# Altium project IntelliModule-Alpha-Baseboard.PrjPcb (part 1 of 2)
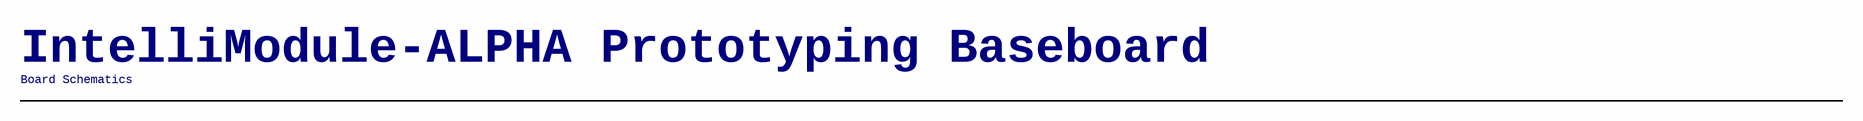
[diagram p0: [01] - Index.SchDoc]
4 sheets, 35 parts. Net scope: global (net labels, ports and power ports of the same name join across sheets).
Board file: IntelliModule-Alpha-Baseboard.PcbDoc
Sheets:
  [01] - Index.SchDoc
  [02] - Module Connector.SchDoc
  [03] - External Connectors.SchDoc
  [04] - Power Supply.SchDoc

## Sheet [01] - Index.SchDoc: Index
size A3; Date: N.A.; ApprovedBy: N.A.; CheckedBy: N.A.; Author: N.A.; CompanyName: Johannes Berndorfer; DrawnBy: JBE; Organization: N.A.; Address1: Konrad Grefe Gasse 22; Address2: 1230 Wien; Address3: AUSTRIA; Address4: N.A.; DocumentNumber: 1; Revision: A; SheetNumber: 1; SheetTotal: 4; ProjectTitle: IntelliModule-Alpha Prototyping Baseboard; Reviewer: -; Time: N.A.; ImagePath: N.A.; Application_BuildNumber: N.A.

### Notes on the sheet
- IntelliModule-ALPHA Prototyping Baseboard
- Board Schematics
- Title:
- Project:
- Document Nr.:
- Revision:
- Date:
- Drawn By:
- Time:
- Reviewed By:
- Sheet
- of
- Size:
- A3
- Variant:
- File:

## Sheet [02] - Module Connector.SchDoc: Module Connector
size A3; Date: N.A.; ApprovedBy: N.A.; CheckedBy: N.A.; Author: N.A.; CompanyName: Johannes Berndorfer; DrawnBy: JBE; Organization: N.A.; Address1: Konrad Grefe Gasse 22; Address2: 1230 Wien; Address3: AUSTRIA; Address4: N.A.; DocumentNumber: 2; Revision: A; SheetNumber: 2; SheetTotal: 4; ProjectTitle: IntelliModule-Alpha Prototyping Baseboard; Reviewer: -; Time: N.A.; ImagePath: N.A.; Application_BuildNumber: N.A.
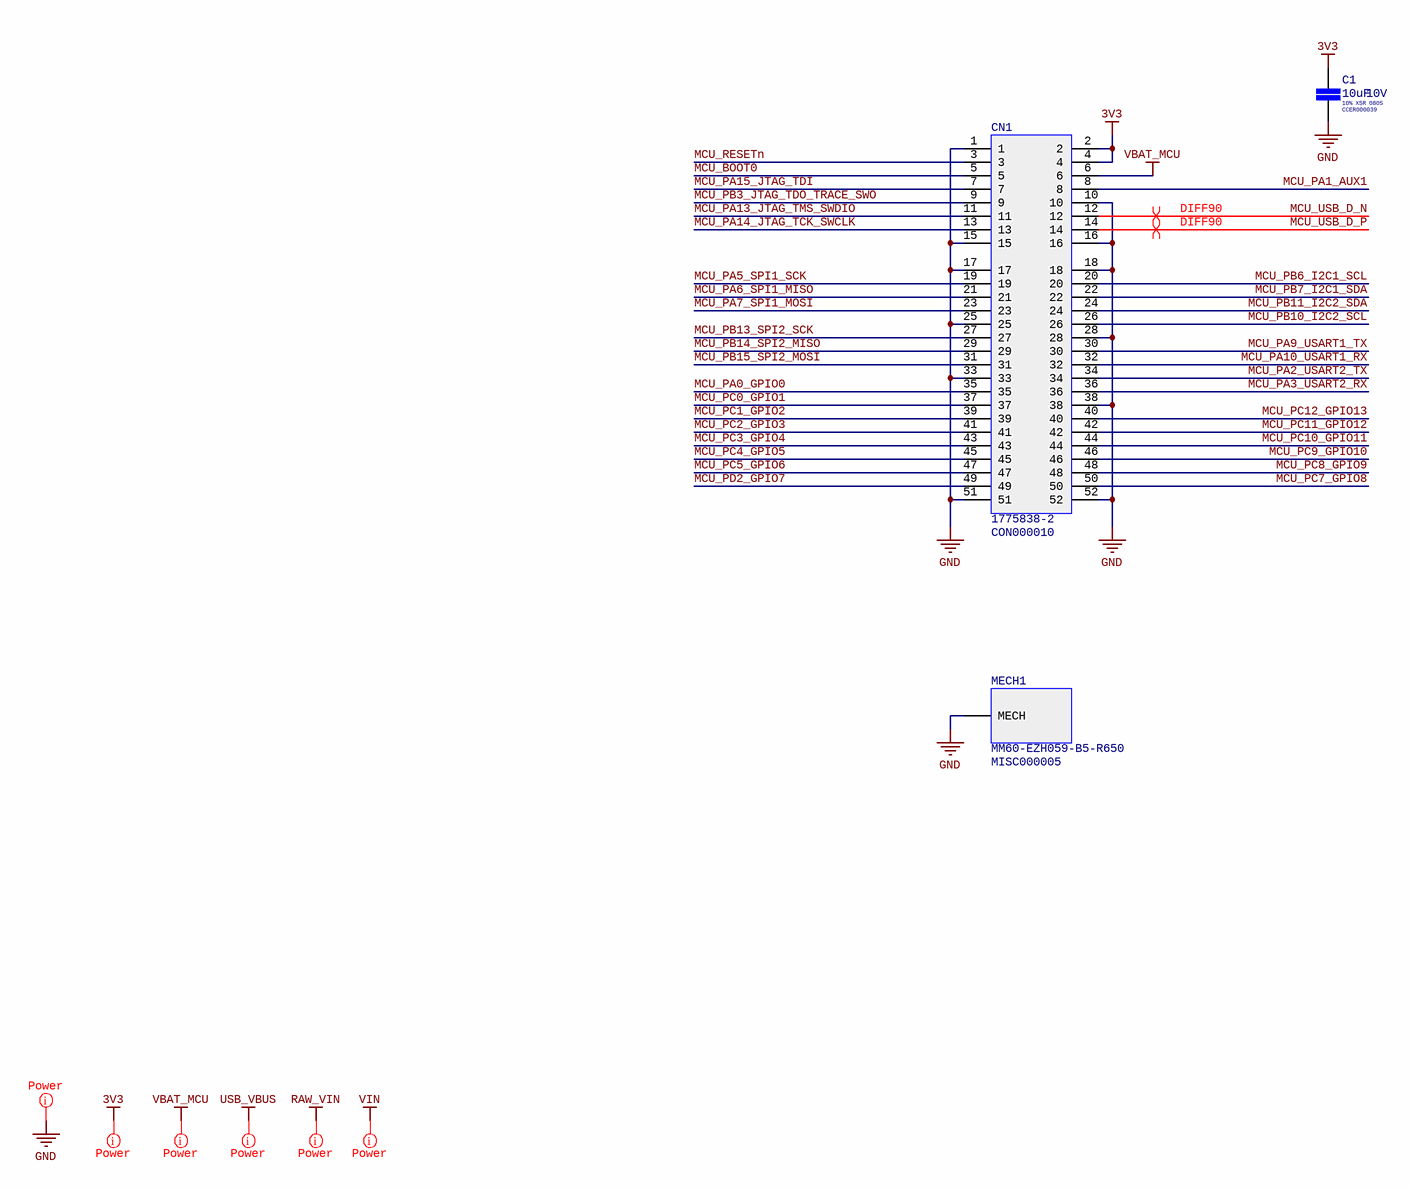
[diagram p1: [02] - Module Connector.SchDoc]

### Parts
C1  Internal Part Number: CCER000039  Tolerance: 10%  Voltage Rating: 10V  Dielectric: X5R  Case/Package: 0805  Capacitance: 10uF  [CAP-SMD-0805-1.35MM-IPC-MED]  (hidden comment: 10uF 10V)
CN1  1775838-2  Internal Part Number: CON000010  [CON-SMD-PCIE-MINI-52POS-1775838-2-TE]
MECH1  MM60-EZH059-B5-R650  Internal Part Number: MISC000005  [CON-SMD-PCIE-MINI-LATCH-0POS-MM60-EZH059-B5-R650-JAE]

### Nets
3V3: C1.1 CN1.2 CN1.4
GND: C1.2 CN1.1 CN1.10 CN1.15 CN1.16 CN1.17 CN1.18 CN1.25 CN1.28 CN1.33 CN1.38 CN1.51 CN1.52 MECH1.0(MECH)
VBAT_MCU: CN1.6
MCU_BOOT0: CN1.5
MCU_PA0_GPIO0: CN1.35
MCU_PA1_AUX1: CN1.8
MCU_PA2_USART2_TX: CN1.34
MCU_PA3_USART2_RX: CN1.36
MCU_PA5_SPI1_SCK: CN1.19
MCU_PA6_SPI1_MISO: CN1.21
MCU_PA7_SPI1_MOSI: CN1.23
MCU_PA9_USART1_TX: CN1.30
MCU_PA10_USART1_RX: CN1.32
MCU_PA13_JTAG_TMS_SWDIO: CN1.11
MCU_PA14_JTAG_TCK_SWCLK: CN1.13
MCU_PA15_JTAG_TDI: CN1.7
MCU_PB3_JTAG_TDO_TRACE_SWO: CN1.9
MCU_PB6_I2C1_SCL: CN1.20
MCU_PB7_I2C1_SDA: CN1.22
MCU_PB10_I2C2_SCL: CN1.26
MCU_PB11_I2C2_SDA: CN1.24
MCU_PB13_SPI2_SCK: CN1.27
MCU_PB14_SPI2_MISO: CN1.29
MCU_PB15_SPI2_MOSI: CN1.31
MCU_PC0_GPIO1: CN1.37
MCU_PC1_GPIO2: CN1.39
MCU_PC2_GPIO3: CN1.41
MCU_PC3_GPIO4: CN1.43
MCU_PC4_GPIO5: CN1.45
MCU_PC5_GPIO6: CN1.47
MCU_PC7_GPIO8: CN1.50
MCU_PC8_GPIO9: CN1.48
MCU_PC9_GPIO10: CN1.46
MCU_PC10_GPIO11: CN1.44
MCU_PC11_GPIO12: CN1.42
MCU_PC12_GPIO13: CN1.40
MCU_PD2_GPIO7: CN1.49
MCU_RESETn: CN1.3
MCU_USB_D_N: CN1.12
MCU_USB_D_P: CN1.14

### Layout directives
differential pair; differential pair class DIFF90: MCU_USB_D_N, MCU_USB_D_P
net class Power: 3V3, GND, RAW_VIN, USB_VBUS, VBAT_MCU, VIN

### Notes on the sheet
- Labels drawn without touching a wire or pin: 3V3, GND, RAW_VIN, USB_VBUS, VBAT_MCU, VIN
- Title:
- Project:
- Document Nr.:
- Revision:
- Date:
- Drawn By:
- Time:
- Reviewed By:
- Sheet
- of
- Size:
- A3
- Variant:
- File:

### Library data of the parts
C1 = CL21A106KPFNNNG: CAP CER 10U 10V X5R 10% SMD 0805 85C SAMSUNG; Supplier 1: Digi-Key; Manufacturer 1: Samsung; Manufacturer Part Number 1: CL21A106KPFNNNG; Stock 1: 884042; Pricing 1: 1=0,14000, 10=0,10000, 100=0,04690, 500=0,03290, 1000=0,02724 (USD); RoHS: Yes; Mount: Surface Mount; Case Code (Metric): 2012; Case Code (Imperial): 0805; Min Operating Temperature: -55°C; Max Operating Temperature: 85°C; Voltage: 10V; Packaging: Tape and Reel; Package Quantity: 3000; Termination: Wraparound; Length: 2mm; Height: 1.25mm; Depth: 1.25mm; Width: 0.049inch; Thickness: 0.053inch; Radiation Hardening: No; Lead Free: Lead Free; ComponentLink1URL: https://datasheet.ciiva.com/16428/cl21a106kpfnnng-16428896.pdf?src-supplier=Future+Electronics; ComponentLink1Description: https://datasheet.ciiva.com/16428/cl21a106kpfnnng-16428896.pdf?src-supplier=Future+Electronics; ComponentLink2URL: https://datasheet.ciiva.com/26936/getdatasheetpartid-640497-26936900.pdf?src-supplier=Verical; ComponentLink2Description: https://datasheet.ciiva.com/26936/getdatasheetpartid-640497-26936900.pdf?src-supplier=Verical; Supplier Part Number 1: 1276-6456-1-ND
CN1 = 1775838-2: CON MINI PCIE CARD EDGE 52POS SMD; Manufacturer 1: TE Connectivity AMP; Connector Type: Receptacle; High Temperature Housing: Yes; Number of Positions: 52; PCB Mount Retention: Without; PCB Mounting Orientation: Vertical; Stackable: No; Pitch: 0.8mm; Row Spacing: 0.031inch; Stack Height: 5.6mm; Supplier 1: Digi-Key; Manufacturer Part Number 1: 1775838-2; Stock 1: 12692; Pricing 1: 1=0,76000, 10=0,67100, 25=0,63160, 50=0,60520, 100=0,57880, 250=0,52620 (USD); RoHS: Yes; Mount: Surface Mount; Contact Plating: Gold; Contact Material: Copper Alloy; Housing Color: Black; Housing Material: Thermoplastic; Number of Rows: 2; Packaging: Tape and Reel; Termination: Solder; Orientation: Right Angle; Package Quantity: 500; Lead Free: Lead Free; ELV: Compliant; Flammability Rating: UL94 V-0; ComponentLink1URL: https://datasheet.ciiva.com/16468/eng-ds-8-1773459-7-express-mini-card-qrg-1011-16468375.pdf?src-supplier=Avnet+Asia; ComponentLink1Description: https://datasheet.ciiva.com/16468/eng-ds-8-1773459-7-express-mini-card-qrg-1011-16468375.pdf?src-supplier=Avnet+Asia; ComponentLink2URL: https://datasheet.ciiva.com/48777/eng-ds-8-1773459-7-express-mini-card-qrg-1011-48777258.pdf?src-supplier=Onlinecomponents.com; ComponentLink2Description: https://datasheet.ciiva.com/48777/eng-ds-8-1773459-7-express-mini-card-qrg-1011-48777258.pdf?src-supplier=Onlinecomponents.com; ComponentLink3URL: https://datasheet.ciiva.com/10924/eng-ds-8-1773459-7-express-mini-card-qrg-1011-10924539.pdf?src-supplier=Avnet; ComponentLink3Description: https://datasheet.ciiva.com/10924/eng-ds-8-1773459-7-express-mini-card-qrg-1011-10924539.pdf?src-supplier=Avnet; Supplier Part Number 1: A123340CT-ND
MECH1 = MM60-EZH059-B5-R650: CARD LATCH MINI PCIE 3.05mm HEIGHT; Manufacturer: JAE Electronics; Contact Resistance: 55mR; Current Rating: 500mA; Mating Cycles: 50; Supplier 1: Digi-Key; Manufacturer Part Number: MM60-EZH059-B5-R650; Stock 1: 14566; Pricing 1: 1 = 1,22000, 10 = 1,07500, 25 = 1,01160, 50 = 0,96940, 100 = 0,92720, 250 = 0,84296 (USD); RoHS: Yes; Mount: Socket; Case/Package: SMD/SMT; Contact Material: Stainless Steel,Tin; Contact Plating: Tin; Min Operating Temperature: -40°C; Max Operating Temperature: 80°C; Packaging: Tape and Reel; Package Quantity: 1; Termination: Solder; Height: 5.9mm; REACH SVHC: Unknown; Flammability Rating: UL94 V-0; ComponentLink1URL: https://datasheet.ciiva.com/682/sj105221-682461.pdf?src-supplier=Digi-Key; ComponentLink1Description: https://datasheet.ciiva.com/682/sj105221-682461.pdf?src-supplier=Digi-Key; ComponentLink2URL: https://datasheet.ciiva.com/7655/332202-7655815.pdf?src-supplier=Element14; ComponentLink2Description: https://datasheet.ciiva.com/7655/332202-7655815.pdf?src-supplier=Element14; Supplier Part Number 1: 670-2277-1-ND

## Sheet [03] - External Connectors.SchDoc: External Connectors
size A3; Date: N.A.; ApprovedBy: N.A.; CheckedBy: N.A.; Author: N.A.; CompanyName: Johannes Berndorfer; DrawnBy: JBE; Organization: N.A.; Address1: Konrad Grefe Gasse 22; Address2: 1230 Wien; Address3: AUSTRIA; Address4: N.A.; DocumentNumber: 3; Revision: A; SheetNumber: 3; SheetTotal: 4; ProjectTitle: IntelliModule-Alpha Prototyping Baseboard; Reviewer: -; Time: N.A.; ImagePath: N.A.; Application_BuildNumber: N.A.
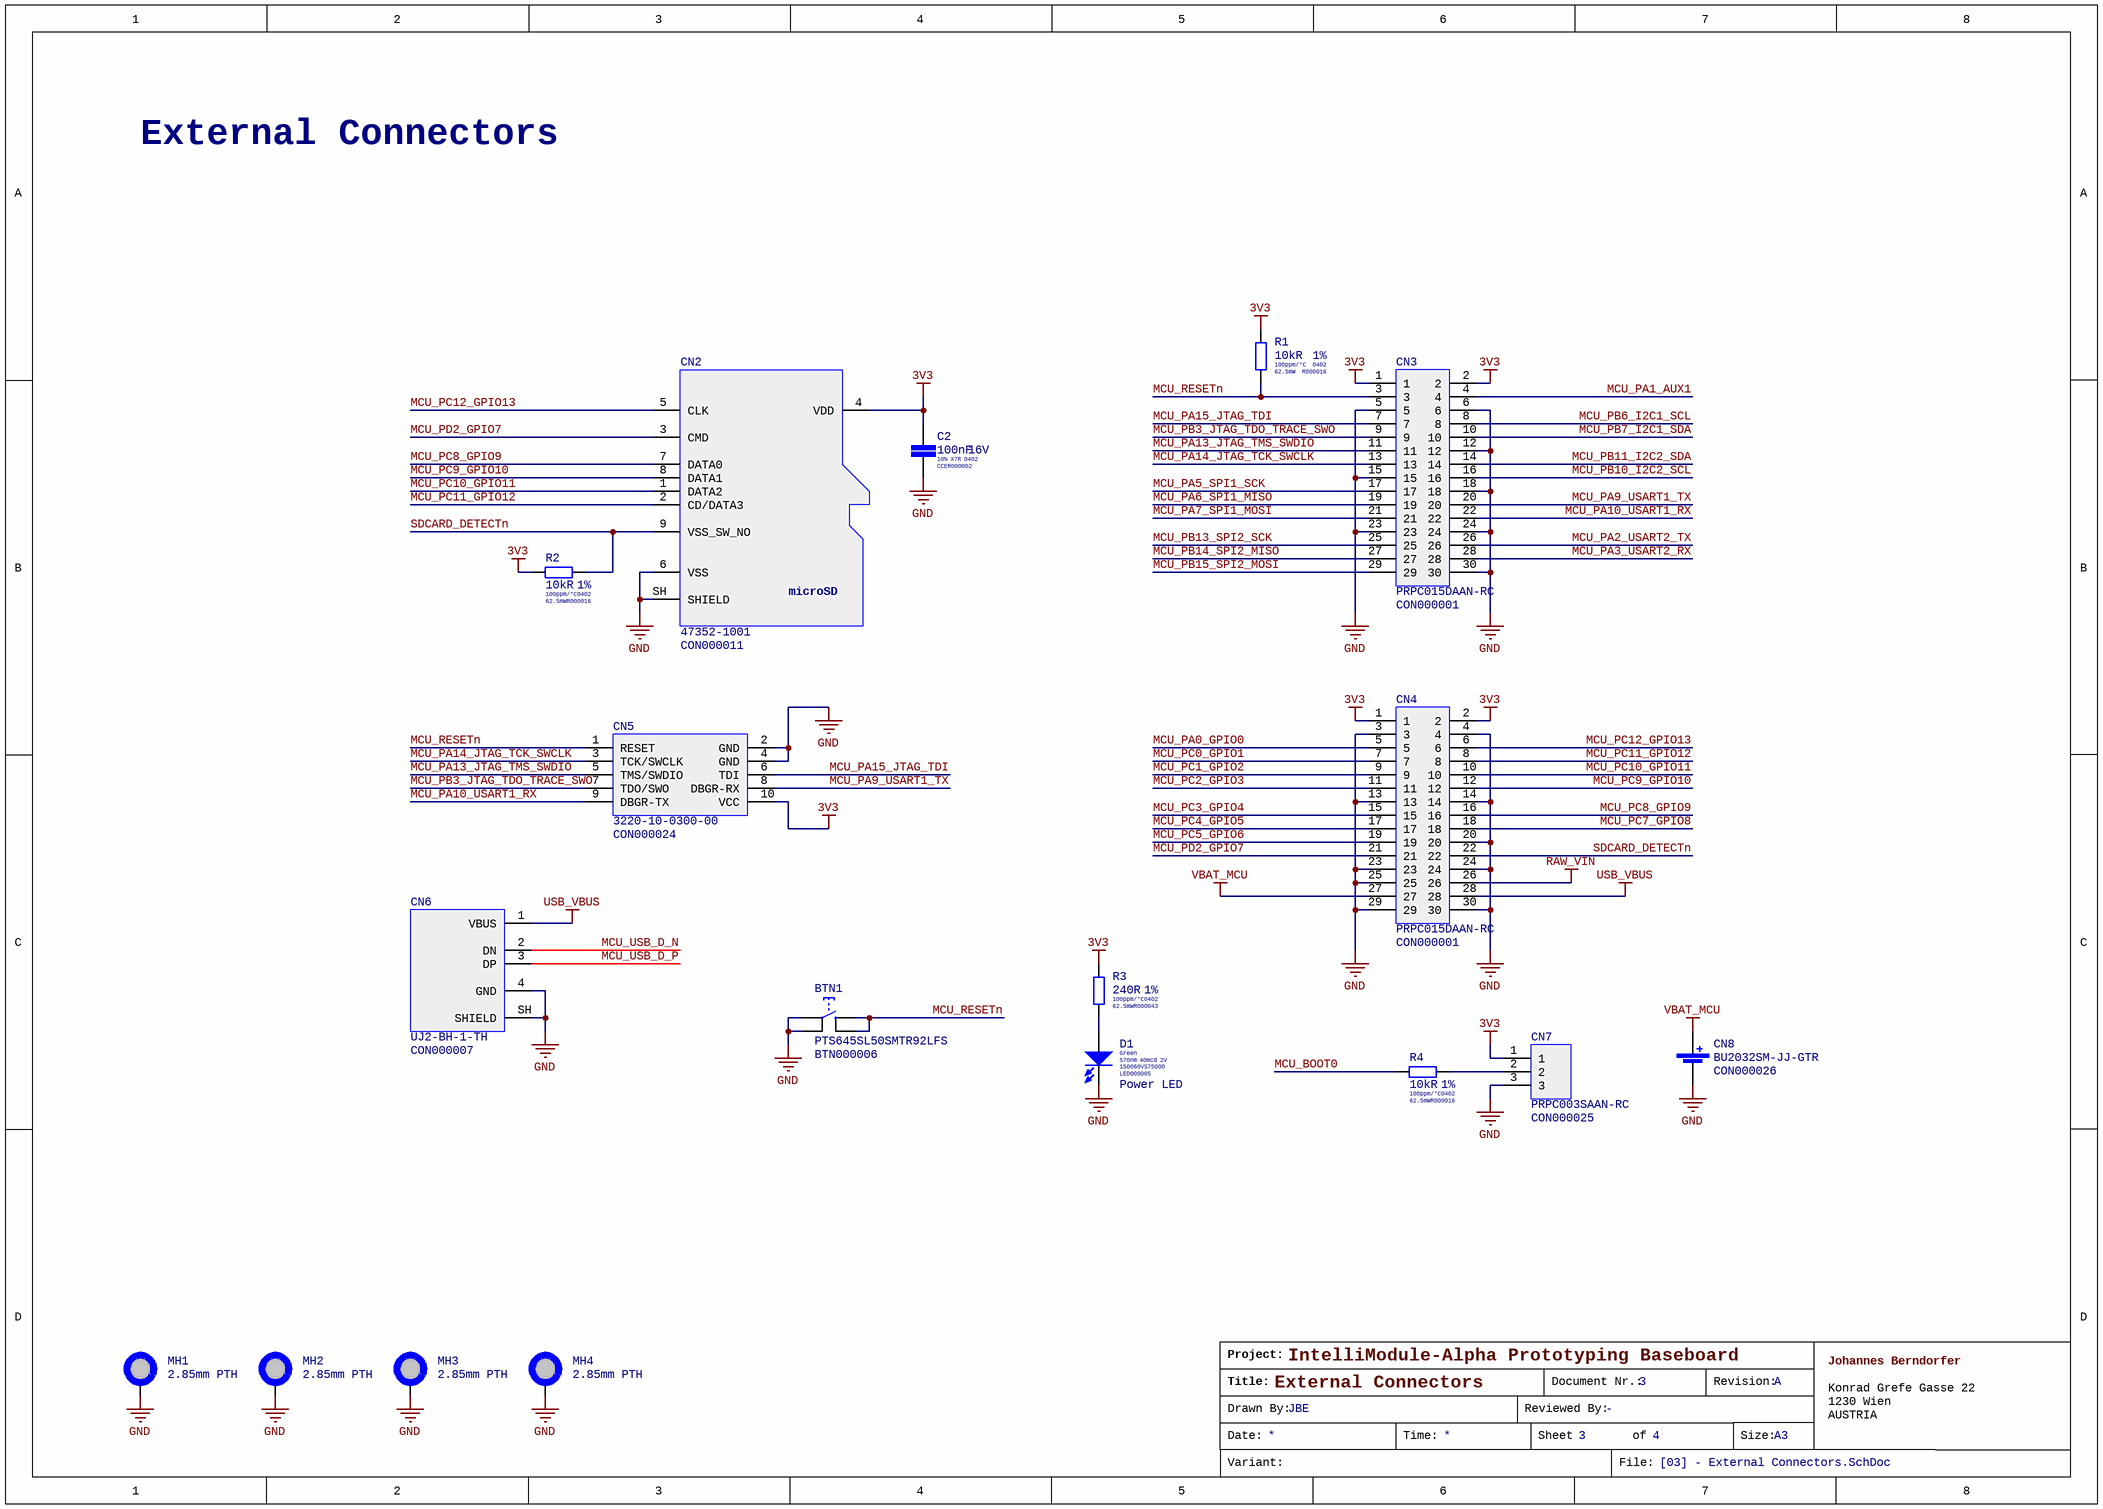
[diagram p2: [03] - External Connectors.SchDoc]

### Parts
BTN1  PTS645SL50SMTR92LFS  Internal Part Number: BTN000006  [BTN-SMD-PTS645-CK]
C2  Tolerance: 10%  Internal Part Number: CCER000002  Voltage Rating (DC): 16V  Dielectric: X7R  Case/Package: 0402  Capacitance: 100nF  [CAP-SMD-0402-0.55MM-IPC-MED]  (hidden comment: 100nF 16V)
CN2  47352-1001  Internal Part Number: CON000011  [CON-SMD-MICROSD-PUSHPULL-9POS-0473521001-MOLEX]
CN3  PRPC015DAAN-RC  Internal Part Number: CON000001  [CON-THT-PINHEADER-2.54MM-30POS-2X15]
CN4  PRPC015DAAN-RC  Internal Part Number: CON000001  [CON-THT-PINHEADER-2.54MM-30POS-2X15]
CN5  3220-10-0300-00  Internal Part Number: CON000024  [CON-SMD-PINHEADER-SHIELDED-1.27MM-10POS-2X5-3220-10-0300-00-CNC-TECH]
CN6  UJ2-BH-1-TH  Internal Part Number: CON000007  [CON-THT-USB-B-4POS-UJ2-BH-1-TH-CUI]
CN7  PRPC003SAAN-RC  Internal Part Number: CON000025  [CON-THT-PINHEADER-2.54MM-3POS-1X3]
CN8  BU2032SM-JJ-GTR  Internal Part Number: CON000026  [CON-SMD-BU2032SM-JJ-GTR]
D1  Luminous Intensity: 40mcd  Forward Voltage: 2V  Color: Green  Wavelength: 570nm  Internal Part Number: LED000005  [LED-SMD-0603]  (hidden comment: 150060VS75000)
MH1  2.85mm PTH  [MECH-HOLE-PTH-2.85MM-5.4MM]
MH2  2.85mm PTH  [MECH-HOLE-PTH-2.85MM-5.4MM]
MH3  2.85mm PTH  [MECH-HOLE-PTH-2.85MM-5.4MM]
MH4  2.85mm PTH  [MECH-HOLE-PTH-2.85MM-5.4MM]
R1  Tolerance: 1%  Temperature Coefficient: 100ppm/°C  Resistance: 10kR  Power Rating: 62.5mW  Case Code (Imperial): 0402  Internal Part Number: R000016  [RES-SMD-0402-0.4MM-IPC-MED]  (hidden comment: 10kR 1%)
R2  Tolerance: 1%  Temperature Coefficient: 100ppm/°C  Resistance: 10kR  Power Rating: 62.5mW  Case Code (Imperial): 0402  Internal Part Number: R000016  [RES-SMD-0402-0.4MM-IPC-MED]  (hidden comment: 10kR 1%)
R3  Resistance: 240R  Tolerance: 1%  Temperature Coefficient: 100ppm/°C  Power Rating: 62.5mW  Case/Package: 0402  Internal Part Number: R000043  [RES-SMD-0402-0.4MM-IPC-MED]  (hidden comment: 240R 1%)
R4  Tolerance: 1%  Temperature Coefficient: 100ppm/°C  Resistance: 10kR  Power Rating: 62.5mW  Case Code (Imperial): 0402  Internal Part Number: R000016  [RES-SMD-0402-0.4MM-IPC-MED]  (hidden comment: 10kR 1%)

### Nets
3V3: C2.1 CN2.4(VDD) CN3.1 CN3.2 CN4.1 CN4.2 CN5.10(VCC) CN7.1 R1.1 R2.1 R3.1
GND: BTN1.1 BTN1.2 C2.2 CN2.6(VSS) CN2.SH(SHIELD) CN3.5 CN3.6 CN3.12 CN3.15 CN3.18 CN3.23 CN3.24 CN3.30 CN4.3 CN4.4 CN4.13 CN4.14 CN4.20 CN4.23 CN4.24 CN4.25 CN4.29 CN4.30 CN5.2(GND) CN5.4(GND) CN6.4(GND) CN6.SH(SHIELD) CN7.3 CN8.2 D1.1 MH1.1 MH2.1 MH3.1 MH4.1
RAW_VIN: CN4.26
USB_VBUS: CN4.28 CN6.1(VBUS)
VBAT_MCU: CN4.27 CN8.1
MCU_BOOT0: R4.1
MCU_PA0_GPIO0: CN4.5
MCU_PA1_AUX1: CN3.4
MCU_PA2_USART2_TX: CN3.26
MCU_PA3_USART2_RX: CN3.28
MCU_PA5_SPI1_SCK: CN3.17
MCU_PA6_SPI1_MISO: CN3.19
MCU_PA7_SPI1_MOSI: CN3.21
MCU_PA9_USART1_TX: CN3.20 CN5.8(DBGR-RX)
MCU_PA10_USART1_RX: CN3.22 CN5.9(DBGR-TX)
MCU_PA13_JTAG_TMS_SWDIO: CN3.11 CN5.5(TMS/SWDIO)
MCU_PA14_JTAG_TCK_SWCLK: CN3.13 CN5.3(TCK/SWCLK)
MCU_PA15_JTAG_TDI: CN3.7 CN5.6(TDI)
MCU_PB3_JTAG_TDO_TRACE_SWO: CN3.9 CN5.7(TDO/SWO)
MCU_PB6_I2C1_SCL: CN3.8
MCU_PB7_I2C1_SDA: CN3.10
MCU_PB10_I2C2_SCL: CN3.16
MCU_PB11_I2C2_SDA: CN3.14
MCU_PB13_SPI2_SCK: CN3.25
MCU_PB14_SPI2_MISO: CN3.27
MCU_PB15_SPI2_MOSI: CN3.29
MCU_PC0_GPIO1: CN4.7
MCU_PC1_GPIO2: CN4.9
MCU_PC2_GPIO3: CN4.11
MCU_PC3_GPIO4: CN4.15
MCU_PC4_GPIO5: CN4.17
MCU_PC5_GPIO6: CN4.19
MCU_PC7_GPIO8: CN4.18
MCU_PC8_GPIO9: CN2.7(DATA0) CN4.16
MCU_PC9_GPIO10: CN2.8(DATA1) CN4.12
MCU_PC10_GPIO11: CN2.1(DATA2) CN4.10
MCU_PC11_GPIO12: CN2.2(CD/DATA3) CN4.8
MCU_PC12_GPIO13: CN2.5(CLK) CN4.6
MCU_PD2_GPIO7: CN2.3(CMD) CN4.21
MCU_RESETn: BTN1.3 BTN1.4 CN3.3 CN5.1(RESET) R1.2
MCU_USB_D_N: CN6.2(DN)
MCU_USB_D_P: CN6.3(DP)
SDCARD_DETECTn: CN2.9(VSS_SW_NO) CN4.22 R2.2
NetCN7_2: CN7.2 R4.2
NetD1_2: D1.2 R3.2

### Notes on the sheet
- (near D1) Power LED
- Title:
- Project:
- Document Nr.:
- Revision:
- Date:
- Drawn By:
- Time:
- Reviewed By:
- Sheet
- of
- Size:
- A3
- Variant:
- File:
- (in symbol MOLEX 47352-1001) microSD

### Library data of the parts
BTN1 = PTS645SL50SMTR92LFS: BTN TACT SPST-NO 12V 50mA SMD BLACK; Manufacturer: ITT C&K; Mechanical Life: 100000Cycles; Actuator Material: Nylon,Polyamide; Operating Force: 1.27N; Throw Configuration: SPST; Illumination Type: Non-Illuminated; Switch Function: Off-Mom; Actuator Type: Standard; Supplier 1: Digi-Key; Manufacturer Part Number: PTS645SL50SMTR92LFS; Stock 1: 127172; Pricing 1: 1 = 0,31000, 10 = 0,30000, 25 = 0,29000, 50 = 0,27960, 100 = 0,26410, 250 = 0,24860, 500 = 0,23822 (USD); RoHS: Yes; Mount: Surface Mount; Color: Black; Contact Plating: Silver; Contact Material: Bronze; Min Operating Temperature: -20°C; Max Operating Temperature: 60°C; Max Voltage Rating (DC): 12V; Current Rating: 50mA; Voltage Rating (DC): 12V; Packaging: Tape and Reel; Package Quantity: 1000; Max Current Rating: 50mA; Termination: Gull Wing; Orientation: Straight; Length: 6mm; Depth: 9mm; REACH SVHC: No SVHC; Lead Free: Lead Free; ComponentLink1URL: https://datasheet.ciiva.com/26927/getdatasheetpartid-760859-26927133.pdf?src-supplier=Verical; ComponentLink1Description: https://datasheet.ciiva.com/26927/getdatasheetpartid-760859-26927133.pdf?src-supplier=Verical; ComponentLink2URL: https://datasheet.ciiva.com/14920/pts645-14920742.pdf?src-supplier=Digi-Key; ComponentLink2Description: https://datasheet.ciiva.com/14920/pts645-14920742.pdf?src-supplier=Digi-Key; ComponentLink3URL: https://datasheet.ciiva.com/14920/pts645-14920743.pdf?src-supplier=Digi-Key; ComponentLink3Description: https://datasheet.ciiva.com/14920/pts645-14920743.pdf?src-supplier=Digi-Key; ComponentLink4URL: https://datasheet.ciiva.com/14920/pts645-14920744.pdf?src-supplier=Digi-Key; ComponentLink4Description: https://datasheet.ciiva.com/14920/pts645-14920744.pdf?src-supplier=Digi-Key; ComponentLink5URL: https://datasheet.ciiva.com/46429/1839862-46429337.pdf?src-supplier=Element14; ComponentLink5Description: https://datasheet.ciiva.com/46429/1839862-46429337.pdf?src-supplier=Element14; ComponentLink6URL: https://datasheet.ciiva.com/46429/1839862-46429338.pdf?src-supplier=Element14; ComponentLink6Description: https://datasheet.ciiva.com/46429/1839862-46429338.pdf?src-supplier=Element14; Supplier Part Number 1: CKN9088CT-ND
C2 = CL05B104KO5NNNC: CAP CER 100N 16V X7R 10% SMD 0402 125C SAMSUNG; Material: Ceramic; Supplier 1: Digi-Key; Manufacturer 1: Samsung; Manufacturer Part Number 1: CL05B104KO5NNNC; Stock 1: 53930414; Pricing 1: 1=0,10000, 10=0,02400, 100=0,01070, 500=0,00766, 1000=0,00602, 2500=0,00548, 5000=0,00504 (USD); RoHS: Yes; Mount: Surface Mount; Case Code (Metric): 1005; Case Code (Imperial): 0402; Contact Plating: Tin; Min Operating Temperature: -55°C; Max Operating Temperature: 125°C; Package Quantity: 1; Packaging: Tape and Reel; Voltage Rating: 16V; Voltage: 16V; Length: 1mm; Height: 0.5mm; Width: 0.02inch; Thickness: 0.022inch; Depth: 0.5mm; Radiation Hardening: No; Lead Free: Lead Free; ComponentLink1URL: https://datasheet.ciiva.com/26920/getdatasheetpartid-359683-26920169.pdf?src-supplier=Verical; ComponentLink1Description: https://datasheet.ciiva.com/26920/getdatasheetpartid-359683-26920169.pdf?src-supplier=Verical; ComponentLink2URL: https://datasheet.ciiva.com/29198/458718-da-01-en-vs-kondensator-0402-29198423.pdf?src-supplier=Conrad; ComponentLink2Description: https://datasheet.ciiva.com/29198/458718-da-01-en-vs-kondensator-0402-29198423.pdf?src-supplier=Conrad; ComponentLink3URL: https://datasheet.ciiva.com/16208/cl05b104kq5nnnc-16208343.pdf?src-supplier=Future+Electronics; ComponentLink3Description: https://datasheet.ciiva.com/16208/cl05b104kq5nnnc-16208343.pdf?src-supplier=Future+Electronics; ComponentLink4URL: https://datasheet.ciiva.com/26309/mlcc-catalogdownload2013-eng-26309003.pdf?src-supplier=Distrelec; ComponentLink4Description: https://datasheet.ciiva.com/26309/mlcc-catalogdownload2013-eng-26309003.pdf?src-supplier=Distrelec; Supplier Part Number 1: 1276-1001-6-ND
CN2 = MOLEX 47352-1001: CON MICROSD SMD PUSH PUSH TYPE VSS SW; Manufacturer 1: Molex; Connector Type: Connector; Number of Contacts: 8; Max Voltage Rating (DC): 100V; Gender: Male; Pitch: 1.1mm; Supplier 1: Digi-Key; Manufacturer Part Number 1: 47352-1001; Stock 1: 16604; Pricing 1: 1=3,94000, 10=3,78500, 25=3,47000, 50=3,31240, 100=3,15460, 250=2,76024 (USD); RoHS: Yes; Mount: Surface Mount; Contact Material: Copper Alloy; Contact Plating: Gold; Housing Material: Polymer; Min Operating Temperature: -20°C; Max Operating Temperature: 85°C; Number of Rows: 1; Packaging: Tape and Reel; Package Quantity: 1; Termination: Solder; Orientation: Right Angle; Length: 14mm; Depth: 15.2mm; Radiation Hardening: No; ComponentLink1URL: https://datasheet.ciiva.com/11755/0900766b80f75287-11755041.pdf?src-supplier=RSComponents; ComponentLink1Description: https://datasheet.ciiva.com/11755/0900766b80f75287-11755041.pdf?src-supplier=RSComponents; ComponentLink2URL: https://datasheet.ciiva.com/16547/0473521001-memory-card-socket-16547169.pdf?src-supplier=Avnet+Europe; ComponentLink2Description: https://datasheet.ciiva.com/16547/0473521001-memory-card-socket-16547169.pdf?src-supplier=Avnet+Europe; ComponentLink3URL: https://datasheet.ciiva.com/683/473521001-sd-683625.pdf?src-supplier=Digi-Key; ComponentLink3Description: https://datasheet.ciiva.com/683/473521001-sd-683625.pdf?src-supplier=Digi-Key; ComponentLink4URL: https://datasheet.ciiva.com/30105/0473521001-memory-card-socket-30105258.pdf?src-supplier=Onlinecomponents.com; ComponentLink4Description: https://datasheet.ciiva.com/30105/0473521001-memory-card-socket-30105258.pdf?src-supplier=Onlinecomponents.com; ComponentLink5URL: https://datasheet.ciiva.com/683/473521001-sd-683627.pdf?src-supplier=Digi-Key; ComponentLink5Description: https://datasheet.ciiva.com/683/473521001-sd-683627.pdf?src-supplier=Digi-Key; Supplier Part Number 1: WM3290CT-ND
CN3 CN4 = PRPC015DAAN-RC: CON PINHDR 2MM54 2X15; Manufacturer: Sullins; Number of Positions: 30; Connector Type: Male Pin; Pitch: 0.1inch; Supplier 1: Digi-Key; Manufacturer Part Number: PRPC015DAAN-RC; Stock 1: 2778; Pricing 1: 1 = 0,74000, 10 = 0,69700, 25 = 0,62680, 50 = 0,55720, 100 = 0,53410, 250 = 0,48764, 500 = 0,46440 (USD); RoHS: Yes; Mount: Through Hole; Color: Black; Contact Plating: Gold; Package Quantity: 1; Number of Rows: 2; Packaging: Bulk; Termination: Solder; Row Spacing: 0.1inch; Contact Mating Length: 0.23inch; ComponentLink1URL: https://datasheet.ciiva.com/741/xrxczzzdxxn-rc-11636-b-741270.pdf?src-supplier=Digi-Key; ComponentLink1Description: https://datasheet.ciiva.com/741/xrxczzzdxxn-rc-11636-b-741270.pdf?src-supplier=Digi-Key; Supplier Part Number 1: S2011EC-15-ND
CN5 = 3220-10-0300-00: CON PINHDR SMD 1.27MM SHIELDED KEYED CNC TECH 10POS; Number of Positions: 10; Connector Type: Male Pin; Pitch: 0.05inch; Supplier 1: Digi-Key; Manufacturer 1: CNC Tech; Manufacturer Part Number 1: 3220-10-0300-00; Stock 1: 107713; Pricing 1: 1=0,74000, 10=0,69000, 100=0,52900, 500=0,46000, 3200=0,34500, 6400=0,33350, 12800=0,30590 (USD); RoHS: Yes; Mount: Surface Mount; Contact Plating: Gold; Package Quantity: 3200; Number of Rows: 2; Packaging: Tray; Termination: Solder; Row Spacing: 0.05inch; ComponentLink1URL: https://datasheet.ciiva.com/18655/3220-xx-0300-00-18655365.pdf?src-supplier=Digi-Key; ComponentLink1Description: https://datasheet.ciiva.com/18655/3220-xx-0300-00-18655365.pdf?src-supplier=Digi-Key; Supplier Part Number 1: 1175-1629-ND
CN6 = UJ2-BH-1-TH: CON USB 2.0 B THROUGH HOLE WHTE INSULATOR; Manufacturer: CUI; Connector Type: Jack; Number of Contacts: 4; Gender: Receptacle; Supplier 1: Digi-Key; Manufacturer Part Number: UJ2-BH-1-TH; Stock 1: 0; RoHS: Yes; Mount: Through Hole,Horizontal; Number of Pins: 4; Packaging: Tray; Orientation: Horizontal; Features: Shielded; Lead Free: Lead Free; ComponentLink1URL: https://www.cui.com/product/resource/digikeypdf/uj2-bh-th.pdf?src-supplier=Digi-Key; ComponentLink1Description: https://www.cui.com/product/resource/digikeypdf/uj2-bh-th.pdf?src-supplier=Digi-Key; Supplier Part Number 1: 102-3999-ND
CN7 = PRPC003SAAN-RC: CON PINHDR 2.54MM 1x03; Manufacturer: Sullins; Number of Positions: 3; Connector Type: Male Pin; Pitch: 0.1inch; Supplier 1: Digi-Key; Manufacturer Part Number: PRPC003SAAN-RC; Stock 1: 16923; Pricing 1: 1 = 0,12000, 10 = 0,10900, 25 = 0,08120, 50 = 0,06960, 100 = 0,06730, 250 = 0,05804, 500 = 0,05572 (USD); RoHS: Yes; Mount: Through Hole; Color: Black; Contact Plating: Gold; Package Quantity: 1; Number of Rows: 1; Packaging: Bulk; Termination: Solder; Contact Mating Length: 0.23inch; ComponentLink1URL: https://datasheet.ciiva.com/741/xrxczzzsxxn-rc-st-11635-b-741242.pdf?src-supplier=Digi-Key; ComponentLink1Description: https://datasheet.ciiva.com/741/xrxczzzsxxn-rc-st-11635-b-741242.pdf?src-supplier=Digi-Key; Supplier Part Number 1: S1011EC-03-ND
CN8 = BU2032SM-JJ-GTR: CON BATTERY HOLDER 2032 COINCELL SMD; Manufacturer: Memory Protection Devices; Number of Cells: 1; Supplier 1: Digi-Key; Manufacturer Part Number: BU2032SM-JJ-GTR; Stock 1: 93681; Pricing 1: 1 = 0,99000, 10 = 0,83600, 100 = 0,69070 (USD); RoHS: Yes; Mount: Surface Mount,PCB; Min Operating Temperature: -40°C; Max Operating Temperature: 280°C; Package Quantity: 400; Termination: SMD/SMT; ComponentLink1URL: https://datasheet.ciiva.com/3/bu2032sm-jj-gtr-datasheet-3835.pdf?src-supplier=Digi-Key; ComponentLink1Description: https://datasheet.ciiva.com/3/bu2032sm-jj-gtr-datasheet-3835.pdf?src-supplier=Digi-Key; ComponentLink2URL: https://datasheet.ciiva.com/3/bu2032sm-jj-gtr-datasheet-3836.pdf?src-supplier=Digi-Key; ComponentLink2Description: https://datasheet.ciiva.com/3/bu2032sm-jj-gtr-datasheet-3836.pdf?src-supplier=Digi-Key; ComponentLink3URL: https://datasheet.ciiva.com/3/bu2032sm-jj-gtr-datasheet-3837.pdf?src-supplier=Digi-Key; ComponentLink3Description: https://datasheet.ciiva.com/3/bu2032sm-jj-gtr-datasheet-3837.pdf?src-supplier=Digi-Key; Supplier Part Number 1: BU2032SM-JJ-GCT-ND
D1 = 150060VS75000: LED GREEN570NM SMD 0603 2V 20mA 40mcd; Manufacturer: Wurth Electronics; Viewing Angle: 140°; Lens Style: Clear,Rectangular; Forward Current: 30mA; Supplier 1: Digi-Key; Stock 1: 94015; Pricing 1: 1 = 0,14000, 50 = 0,12900, 100 = 0,11000, 500 = 0,09500 (USD); RoHS: Yes; Mount: Surface Mount; Case/Package: 0603; Number of Pins: 2; Case Code (Metric): 1608; Case Code (Imperial): 0603; Min Operating Temperature: -40°C; Max Operating Temperature: 85°C; Package Quantity: 1; Packaging: Tape and Reel; Dominant Wavelength: 570nm; Test Current: 20mA; Length: 1.6mm; Height: 0.7mm; Width: 0.8mm; REACH SVHC: Unknown; ComponentLink1URL: https://datasheet.ciiva.com/23843/150060vs75000-23843249.pdf?src-supplier=Newark; ComponentLink1Description: https://datasheet.ciiva.com/23843/150060vs75000-23843249.pdf?src-supplier=Newark; ComponentLink2URL: https://datasheet.ciiva.com/29279/759431-da-01-en-chipled-0603-w-kl-h-gruen-150060vs7500-29279199.pdf?src-supplier=Conrad; ComponentLink2Description: https://datasheet.ciiva.com/29279/759431-da-01-en-chipled-0603-w-kl-h-gruen-150060vs7500-29279199.pdf?src-supplier=Conrad; ComponentLink3URL: https://datasheet.ciiva.com/29562/150060vs75000-29562919.pdf?src-supplier=Digi-Key; ComponentLink3Description: https://datasheet.ciiva.com/29562/150060vs75000-29562919.pdf?src-supplier=Digi-Key; ComponentLink4URL: https://datasheet.ciiva.com/29562/150060vs75000-29562920.pdf?src-supplier=Digi-Key; ComponentLink4Description: https://datasheet.ciiva.com/29562/150060vs75000-29562920.pdf?src-supplier=Digi-Key; ComponentLink5URL: https://datasheet.ciiva.com/29562/150060vs75000-29562921.pdf?src-supplier=Digi-Key; ComponentLink5Description: https://datasheet.ciiva.com/29562/150060vs75000-29562921.pdf?src-supplier=Digi-Key; ComponentLink6URL: https://datasheet.ciiva.com/48430/150060vs75000-eng-tds-48430043.pdf?src-supplier=Distrelec; ComponentLink6Description: https://datasheet.ciiva.com/48430/150060vs75000-eng-tds-48430043.pdf?src-supplier=Distrelec; Supplier Part Number 1: 732-4980-1-ND; Manufacturer Part Number: 150060VS75000
MH1-MH4 = MECH-HOLE-PTH-2.85MM-5.4MM: 2.85mm Diameter 5.4mm Pad Plated Through Hole
R1 R2 R4 = RC0402FR-0710KL: RES 10K 1% 1/16W SMD 0402 YAEGO; Manufacturer: Yageo; Voltage Rating: 50V; Manufacturer Part Number: RC0402FR-0710KL; RoHS: Yes; Case/Package: 0402; Number of Pins: 2; Case Code (Metric): 1005; Min Operating Temperature: -55°C; Max Operating Temperature: 155°C; Packaging: Tape and Reel; Composition: Thick Film; Voltage Rating (DC): 50V; Termination: SMD/SMT; Military Standard: Not; Working Voltage: 50V; Number of Terminations: 2; Length: 1mm; Height: 0.32mm; Width: 0.5mm; Depth: 0.5mm; Lead Pitch: 0.2mm; REACH SVHC: No SVHC; Lead Free: Lead Free; ComponentLink1URL: https://datasheet.ciiva.com/7660/38568-7660787.pdf?src-supplier=Element14; ComponentLink1Description: https://datasheet.ciiva.com/7660/38568-7660787.pdf?src-supplier=Element14; ComponentLink2URL: https://datasheet.ciiva.com/7849/1784430-7849813.pdf?src-supplier=Element14; ComponentLink2Description: https://datasheet.ciiva.com/7849/1784430-7849813.pdf?src-supplier=Element14; ComponentLink3URL: https://datasheet.ciiva.com/7849/1686128-7849814.pdf?src-supplier=Element14; ComponentLink3Description: https://datasheet.ciiva.com/7849/1686128-7849814.pdf?src-supplier=Element14; ComponentLink4URL: https://datasheet.ciiva.com/7849/1784430-7849815.pdf?src-supplier=Element14; ComponentLink4Description: https://datasheet.ciiva.com/7849/1784430-7849815.pdf?src-supplier=Element14; ComponentLink5URL: https://datasheet.ciiva.com/22747/1018594-22747512.pdf?src-supplier=Element14; ComponentLink5Description: https://datasheet.ciiva.com/22747/1018594-22747512.pdf?src-supplier=Element14; ComponentLink6URL: https://datasheet.ciiva.com/12667/pyu-rc0402-51-rohs-l-6-r-12667067.pdf?src-supplier=Mouser; ComponentLink6Description: https://datasheet.ciiva.com/12667/pyu-rc0402-51-rohs-l-6-r-12667067.pdf?src-supplier=Mouser; ComponentLink7URL: https://datasheet.ciiva.com/7983/1018594-7983486.pdf?src-supplier=Element14; ComponentLink7Description: https://datasheet.ciiva.com/7983/1018594-7983486.pdf?src-supplier=Element14; Package Quantity: 10000; ComponentLink8URL: https://datasheet.ciiva.com/11819/0900766b80c66297-11819487.pdf?src-supplier=RSComponents; ComponentLink8Description: https://datasheet.ciiva.com/11819/0900766b80c66297-11819487.pdf?src-supplier=RSComponents; ComponentLink9URL: https://datasheet.ciiva.com/15189/getdatasheetpartid-329253-15189431.pdf?src-supplier=Verical; ComponentLink9Description: https://datasheet.ciiva.com/15189/getdatasheetpartid-329253-15189431.pdf?src-supplier=Verical; ComponentLink10URL: https://datasheet.ciiva.com/24070/pyu-rc0402-51-rohs-l-6-r-8721-24070077.pdf?src-supplier=Mouser; ComponentLink10Description: https://datasheet.ciiva.com/24070/pyu-rc0402-51-rohs-l-6-r-8721-24070077.pdf?src-supplier=Mouser; ComponentLink11URL: https://datasheet.ciiva.com/7849/1018594-7849966.pdf?src-supplier=Element14; ComponentLink11Description: https://datasheet.ciiva.com/7849/1018594-7849966.pdf?src-supplier=Element14; ComponentLink12URL: https://datasheet.ciiva.com/7849/1018594-7849967.pdf?src-supplier=Element14; ComponentLink12Description: https://datasheet.ciiva.com/7849/1018594-7849967.pdf?src-supplier=Element14; ComponentLink13URL: https://datasheet.ciiva.com/17070/pyu-rc0402-51-rohs-l-6-r-17070335.pdf?src-supplier=Future+Electronics; ComponentLink13Description: https://datasheet.ciiva.com/17070/pyu-rc0402-51-rohs-l-6-r-17070335.pdf?src-supplier=Future+Electronics; Supplier 1: Digi-Key; Stock 1: 86154015; Pricing 1: 1 = 0,10000, 10 = 0,01600, 100 = 0,00670, 1000 = 0,00301, 2500 = 0,00261, 5000 = 0,00215 (USD); Supplier Part Number 1: 311-10.0KLRCT-ND
R3 = RC0402FR-07240RL: RES 240R 1% 1/16W SMD 0402 YAGEO; Manufacturer: Yageo Phycomp; Voltage Rating (DC): 50V; Supplier 1: Digi-Key; Manufacturer Part Number: RC0402FR-07240RL; Stock 1: 5684518; Pricing 1: 1 = 0,10000, 10 = 0,01600, 100 = 0,00670, 1000 = 0,00301, 2500 = 0,00261, 5000 = 0,00215 (USD); RoHS: Yes; Mount: Surface Mount; Number of Pins: 2; Min Operating Temperature: -55°C; Max Operating Temperature: 155°C; Packaging: Cut Tape; Length: 1mm; Height: 0.32mm; Depth: 0.5mm; REACH SVHC: No SVHC; Lead Free: Lead Free; ComponentLink1URL: http://www.mouser.com/ds/2/447/PYu-RC0402_51_RoHS_L_6_r-8721.pdf?src-supplier=Mouser; ComponentLink1Description: http://www.mouser.com/ds/2/447/PYu-RC0402_51_RoHS_L_6_r-8721.pdf?src-supplier=Mouser; ComponentLink2URL: http://www.farnell.com/datasheets/2167052.pdf?src-supplier=Farnell; ComponentLink2Description: http://www.farnell.com/datasheets/2167052.pdf?src-supplier=Farnell; ComponentLink3URL: http://www.yageo.com/documents/recent/PYu-RC_Group_51_RoHS_L_9.pdf?src-supplier=Digi-Key; ComponentLink3Description: http://www.yageo.com/documents/recent/PYu-RC_Group_51_RoHS_L_9.pdf?src-supplier=Digi-Key; ComponentLink4URL: http://www.yageo.com/documents/recent/PYu-RC_Group_51_RoHS_L_10.pdf?src-supplier=Digi-Key; ComponentLink4Description: http://www.yageo.com/documents/recent/PYu-RC_Group_51_RoHS_L_10.pdf?src-supplier=Digi-Key; ComponentLink5URL: http://www.farnell.com/datasheets/2167052.pdf?src-supplier=Element14; ComponentLink5Description: http://www.farnell.com/datasheets/2167052.pdf?src-supplier=Element14; Supplier Part Number 1: 311-240LRCT-ND

## Sheet [04] - Power Supply.SchDoc: Power Supply
size A3; Date: N.A.; ApprovedBy: N.A.; CheckedBy: N.A.; Author: N.A.; CompanyName: Johannes Berndorfer; DrawnBy: JBE; Organization: N.A.; Address1: Konrad Grefe Gasse 22; Address2: 1230 Wien; Address3: AUSTRIA; Address4: N.A.; DocumentNumber: 4; Revision: A; SheetNumber: 4; SheetTotal: 4; ProjectTitle: IntelliModule-Alpha Prototyping Baseboard; Reviewer: -; Time: N.A.; ImagePath: N.A.; Application_BuildNumber: N.A.
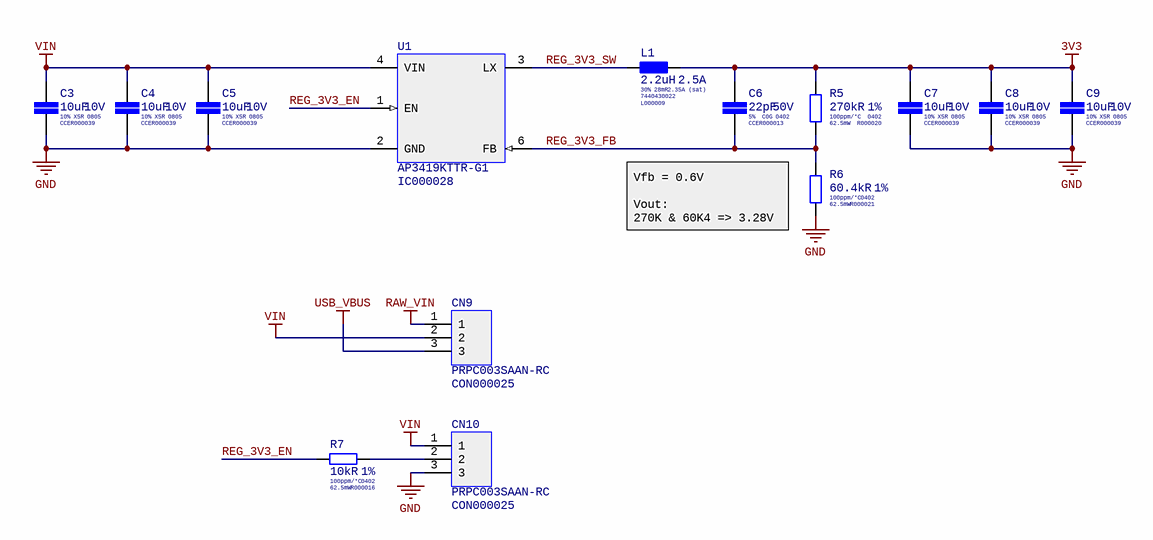
[diagram p3: [04] - Power Supply.SchDoc]

### Parts
C3  Internal Part Number: CCER000039  Tolerance: 10%  Voltage Rating: 10V  Dielectric: X5R  Case/Package: 0805  Capacitance: 10uF  [CAP-SMD-0805-1.35MM-IPC-MED]  (hidden comment: 10uF 10V)
C4  Internal Part Number: CCER000039  Tolerance: 10%  Voltage Rating: 10V  Dielectric: X5R  Case/Package: 0805  Capacitance: 10uF  [CAP-SMD-0805-1.35MM-IPC-MED]  (hidden comment: 10uF 10V)
C5  Internal Part Number: CCER000039  Tolerance: 10%  Voltage Rating: 10V  Dielectric: X5R  Case/Package: 0805  Capacitance: 10uF  [CAP-SMD-0805-1.35MM-IPC-MED]  (hidden comment: 10uF 10V)
C6  Internal Part Number: CCER000013  Voltage Rating: 50V  Tolerance: 5%  Dielectric: C0G  Case/Package: 0402  Capacitance: 22pF  [CAP-SMD-0402-0.55MM-IPC-MED]  (hidden comment: 22pF 50V)
C7  Internal Part Number: CCER000039  Tolerance: 10%  Voltage Rating: 10V  Dielectric: X5R  Case/Package: 0805  Capacitance: 10uF  [CAP-SMD-0805-1.35MM-IPC-MED]  (hidden comment: 10uF 10V)
C8  Internal Part Number: CCER000039  Tolerance: 10%  Voltage Rating: 10V  Dielectric: X5R  Case/Package: 0805  Capacitance: 10uF  [CAP-SMD-0805-1.35MM-IPC-MED]  (hidden comment: 10uF 10V)
C9  Internal Part Number: CCER000039  Tolerance: 10%  Voltage Rating: 10V  Dielectric: X5R  Case/Package: 0805  Capacitance: 10uF  [CAP-SMD-0805-1.35MM-IPC-MED]  (hidden comment: 10uF 10V)
CN9  PRPC003SAAN-RC  Internal Part Number: CON000025  [CON-THT-PINHEADER-2.54MM-3POS-1X3]
CN10  PRPC003SAAN-RC  Internal Part Number: CON000025  [CON-THT-PINHEADER-2.54MM-3POS-1X3]
L1  Saturation Current: 2.35A (sat)  Internal Part Number: L000009  Inductance Tolerance: 30%  DC Resistance (DCR): 28mR  Current Rating: 2.5A  Inductance: 2.2uH  [IND-SMD-7440430022-3MM]  (hidden comment: 7440430022)
R5  Case/Package: 0402  Tolerance: 1%  Temperature Coefficient: 100ppm/°C  Resistance: 270kR  Max Power Dissipation: 62.5mW  Internal Part Number: R000020  [RES-SMD-0402-0.4MM-IPC-MED]  (hidden comment: RC0402FR-07270KL)
R6  Resistance: 60.4kR  Tolerance: 1%  Temperature Coefficient: 100ppm/°C  Case/Package: 0402  Power Rating: 62.5mW  Internal Part Number: R000021  [RES-SMD-0402-0.4MM-IPC-MED]  (hidden comment: RC0402FR-0760K4L)
R7  Tolerance: 1%  Temperature Coefficient: 100ppm/°C  Resistance: 10kR  Power Rating: 62.5mW  Case Code (Imperial): 0402  Internal Part Number: R000016  [RES-SMD-0402-0.4MM-IPC-MED]  (hidden comment: 10kR 1%)
U1  AP3419KTTR-G1  Internal Part Number: IC000028  [SOT-23-6-H1MM-DIODES-INC]

### Nets
3V3: C6.1 C7.1 C8.1 C9.1 L1.2 R5.1
GND: C3.2 C4.2 C5.2 C7.2 C8.2 C9.2 CN10.3 R6.2 U1.2(GND)
RAW_VIN: CN9.1
USB_VBUS: CN9.3
VIN: C3.1 C4.1 C5.1 CN9.2 CN10.1 U1.4(VIN)
REG_3V3_EN: R7.1 U1.1(EN)
REG_3V3_FB: C6.2 R5.2 R6.1 U1.6(FB)
REG_3V3_SW: L1.1 U1.3(LX)
NetCN10_2: CN10.2 R7.2

### Notes on the sheet
- (near R6) Vfb = 0.6V
  Vout:
  270K & 60K4 => 3.28V
- Title:
- Project:
- Document Nr.:
- Revision:
- Date:
- Drawn By:
- Time:
- Reviewed By:
- Sheet
- of
- Size:
- A3
- Variant:
- File:

### Library data of the parts
C3-C5 C7-C9 = CL21A106KPFNNNG: as C1 on sheet [02] - Module Connector; Supplier 1: Digi-Key; Manufacturer 1: Samsung; Manufacturer Part Number 1: CL21A106KPFNNNG; Stock 1: 884042; Pricing 1: 1=0,14000, 10=0,10000, 100=0,04690, 500=0,03290, 1000=0,02724 (USD); RoHS: Yes; Mount: Surface Mount; Case Code (Metric): 2012; Case Code (Imperial): 0805; Min Operating Temperature: -55°C; Max Operating Temperature: 85°C; Voltage: 10V; Packaging: Tape and Reel; Package Quantity: 3000; Termination: Wraparound; Length: 2mm; Height: 1.25mm; Depth: 1.25mm; Width: 0.049inch; Thickness: 0.053inch; Radiation Hardening: No; Lead Free: Lead Free; ComponentLink1URL: https://datasheet.ciiva.com/16428/cl21a106kpfnnng-16428896.pdf?src-supplier=Future+Electronics; ComponentLink1Description: https://datasheet.ciiva.com/16428/cl21a106kpfnnng-16428896.pdf?src-supplier=Future+Electronics; ComponentLink2URL: https://datasheet.ciiva.com/26936/getdatasheetpartid-640497-26936900.pdf?src-supplier=Verical; ComponentLink2Description: https://datasheet.ciiva.com/26936/getdatasheetpartid-640497-26936900.pdf?src-supplier=Verical; Supplier Part Number 1: 1276-6456-1-ND
C6 = CL05C220JB5NNNC: CAP CER 22P 50V C0G 5% SMD 0402 125C SAMSUNG; Material: Ceramic; Temperature Coefficient: 300ppm/°C; Supplier 1: Digi-Key; Manufacturer: Samsung; Manufacturer Part Number: CL05C220JB5NNNC; Stock 1: 1663917; Pricing 1: 1 = 0,10000, 10 = 0,03300, 100 = 0,01480, 500 = 0,01058, 1000 = 0,00831, 2500 = 0,00755, 5000 = 0,00695 (USD); RoHS: Yes; Mount: Surface Mount; Case Code (Metric): 1005; Case Code (Imperial): 0402; Contact Plating: Tin; Min Operating Temperature: -55°C; Max Operating Temperature: 125°C; Package Quantity: 1; Packaging: Tape and Reel; Voltage: 50V; Length: 1mm; Height: 0.5mm; Width: 0.02inch; Thickness: 0.022inch; Depth: 0.5mm; Radiation Hardening: No; ComponentLink1URL: https://datasheet.ciiva.com/15195/getdatasheetpartid-358448-15195679.pdf?src-supplier=Verical; ComponentLink1Description: https://datasheet.ciiva.com/15195/getdatasheetpartid-358448-15195679.pdf?src-supplier=Verical; ComponentLink2URL: https://datasheet.ciiva.com/29198/458663-da-01-en-vs-kondensator-0402-29198414.pdf?src-supplier=Conrad; ComponentLink2Description: https://datasheet.ciiva.com/29198/458663-da-01-en-vs-kondensator-0402-29198414.pdf?src-supplier=Conrad; ComponentLink3URL: https://datasheet.ciiva.com/16199/cl05b104kq5nnnc-16199080.pdf?src-supplier=Future+Electronics; ComponentLink3Description: https://datasheet.ciiva.com/16199/cl05b104kq5nnnc-16199080.pdf?src-supplier=Future+Electronics; ComponentLink4URL: https://datasheet.ciiva.com/26309/mlcc-catalogdownload2013-eng-26309032.pdf?src-supplier=Distrelec; ComponentLink4Description: https://datasheet.ciiva.com/26309/mlcc-catalogdownload2013-eng-26309032.pdf?src-supplier=Distrelec; Supplier Part Number 1: 1276-1116-1-ND
CN9 CN10 = PRPC003SAAN-RC: as CN7 on sheet [03] - External Connectors; Supplier 1: Digi-Key; Manufacturer Part Number: PRPC003SAAN-RC; Stock 1: 16923; Pricing 1: 1 = 0,12000, 10 = 0,10900, 25 = 0,08120, 50 = 0,06960, 100 = 0,06730, 250 = 0,05804, 500 = 0,05572 (USD); RoHS: Yes; Mount: Through Hole; Color: Black; Contact Plating: Gold; Package Quantity: 1; Number of Rows: 1; Packaging: Bulk; Termination: Solder; Contact Mating Length: 0.23inch; ComponentLink1URL: https://datasheet.ciiva.com/741/xrxczzzsxxn-rc-st-11635-b-741242.pdf?src-supplier=Digi-Key; ComponentLink1Description: https://datasheet.ciiva.com/741/xrxczzzsxxn-rc-st-11635-b-741242.pdf?src-supplier=Digi-Key; Supplier Part Number 1: S1011EC-03-ND
L1 = 7440430022: IND 2U2 2A5 28mR 30% SMD FERRITE WURTH; Manufacturer: Wurth Electronics; Shielding: Shielded; Self Resonant Frequency: 100MHz; Test Frequency: 100kHz; Supplier 1: Digi-Key; Stock 1: 3943; Pricing 1: 1 = 1,43000, 10 = 1,38900, 50 = 1,31900, 100 = 1,21500, 250 = 1,14600 (USD); RoHS: Yes; Mount: Surface Mount; Case/Package: 1919; Weight: 0.009065oz; Core Material: Ferrite; Case Code (Metric): 4848; Case Code (Imperial): 1919; Min Operating Temperature: -40°C; Max Operating Temperature: 125°C; Package Quantity: 500; Packaging: Tape and Reel; Tolerance: 30%; Composition: Wirewound; Max DC Current: 2.5A; Termination: SMD/SMT; RMS Current (Irms): 2.5A; Series Resistance: 28mR; Length: 4.8mm; Height: 2.8mm; Width: 4.8mm; Height - Seated (Max): 0.118inch; Depth: 4.8mm; REACH SVHC: Unknown; Lead Free: Lead Free; ComponentLink1URL: https://datasheet.ciiva.com/11803/0900766b80febc3e-11803289.pdf?src-supplier=RSComponents; ComponentLink1Description: https://datasheet.ciiva.com/11803/0900766b80febc3e-11803289.pdf?src-supplier=RSComponents; ComponentLink2URL: https://datasheet.ciiva.com/7754/1735426-7754427.pdf?src-supplier=Element14; ComponentLink2Description: https://datasheet.ciiva.com/7754/1735426-7754427.pdf?src-supplier=Element14; ComponentLink3URL: https://datasheet.ciiva.com/13277/7440430022-66848-13277005.pdf?src-supplier=Mouser; ComponentLink3Description: https://datasheet.ciiva.com/13277/7440430022-66848-13277005.pdf?src-supplier=Mouser; ComponentLink4URL: https://datasheet.ciiva.com/1075/7440430022-1075984.pdf?src-supplier=Digi-Key; ComponentLink4Description: https://datasheet.ciiva.com/1075/7440430022-1075984.pdf?src-supplier=Digi-Key; ComponentLink5URL: https://datasheet.ciiva.com/23782/1645803-23782392.pdf?src-supplier=Newark; ComponentLink5Description: https://datasheet.ciiva.com/23782/1645803-23782392.pdf?src-supplier=Newark; ComponentLink6URL: https://datasheet.ciiva.com/1075/7440430022-1075985.pdf?src-supplier=Digi-Key; ComponentLink6Description: https://datasheet.ciiva.com/1075/7440430022-1075985.pdf?src-supplier=Digi-Key; ComponentLink7URL: https://datasheet.ciiva.com/1075/7440430022-1075986.pdf?src-supplier=Digi-Key; ComponentLink7Description: https://datasheet.ciiva.com/1075/7440430022-1075986.pdf?src-supplier=Digi-Key; ComponentLink8URL: https://datasheet.ciiva.com/48690/001087187-da-01-ml-we-tpc-smd-speicherdrossel-7440430-de-en-48690886.pdf?src-supplier=Conrad; ComponentLink8Description: https://datasheet.ciiva.com/48690/001087187-da-01-ml-we-tpc-smd-speicherdrossel-7440430-de-en-48690886.pdf?src-supplier=Conrad; Supplier Part Number 1: 732-1095-1-ND; Manufacturer Part Number: 7440430022
R5 = RC0402FR-07270KL: RES 270K 1% 1/16W SMD 0402 YAEGO; Manufacturer: Yageo; Power Rating: 63mW; Voltage Rating: 50V; Supplier 1: Digi-Key; Manufacturer Part Number: RC0402FR-07270KL; Stock 1: 339624; Pricing 1: 1 = 0,10000, 10 = 0,01600, 100 = 0,00640, 1000 = 0,00289, 2500 = 0,00251, 5000 = 0,00207 (USD); RoHS: Yes; Weight: 2.3E-05oz; Case Code (Imperial): 0402; Case Code (Metric): 1005; Min Operating Temperature: -55°C; Max Operating Temperature: 155°C; Packaging: Tape and Reel; Package Quantity: 1; Termination: SMD/SMT; Composition: Thick Film; Number of Terminations: 2; Military Standard: Not; Features: Moisture Resistant; Length: 1mm; Height: 0.016inch; Width: 0.5mm; Depth: 0.5mm; REACH SVHC: Unknown; Lead Free: Lead Free; ComponentLink1URL: https://datasheet.ciiva.com/2491/pyu-r-int-thick-7-2491341.pdf?src-supplier=Digi-Key; ComponentLink1Description: https://datasheet.ciiva.com/2491/pyu-r-int-thick-7-2491341.pdf?src-supplier=Digi-Key; ComponentLink2URL: https://datasheet.ciiva.com/15189/getdatasheetpartid-327811-15189397.pdf?src-supplier=Verical; ComponentLink2Description: https://datasheet.ciiva.com/15189/getdatasheetpartid-327811-15189397.pdf?src-supplier=Verical; ComponentLink3URL: https://datasheet.ciiva.com/16772/pyu-rc0402-51-rohs-l-6-r-16772665.pdf?src-supplier=Future+Electronics; ComponentLink3Description: https://datasheet.ciiva.com/16772/pyu-rc0402-51-rohs-l-6-r-16772665.pdf?src-supplier=Future+Electronics; ComponentLink4URL: https://datasheet.ciiva.com/2491/pyu-r-int-thick-7-2491339.pdf?src-supplier=Digi-Key; ComponentLink4Description: https://datasheet.ciiva.com/2491/pyu-r-int-thick-7-2491339.pdf?src-supplier=Digi-Key; ComponentLink5URL: https://datasheet.ciiva.com/2491/pyu-r-int-thick-7-2491340.pdf?src-supplier=Digi-Key; ComponentLink5Description: https://datasheet.ciiva.com/2491/pyu-r-int-thick-7-2491340.pdf?src-supplier=Digi-Key; Supplier Part Number 1: 311-270KLRCT-ND
R6 = RC0402FR-0760K4L: RES 60K4 1% 1/16W SMD 0402 YAEGO; Manufacturer: Yageo; Voltage Rating: 50V; Supplier 1: Digi-Key; Manufacturer Part Number: RC0402FR-0760K4L; Stock 1: 969860; Pricing 1: 1 = 0,10000, 10 = 0,01600, 100 = 0,00640, 1000 = 0,00289, 2500 = 0,00251, 5000 = 0,00207 (USD); RoHS: Yes; Case Code (Imperial): 0402; Case Code (Metric): 1005; Contact Plating: Tin,Matte; Min Operating Temperature: -55°C; Max Operating Temperature: 155°C; Packaging: Tape and Reel; Termination: SMD/SMT; Composition: Thick Film; Military Standard: Not; Voltage Rating (DC): 50V; Length: 1mm; Depth: 0.5mm; Width: 500um; Lead Free: Lead Free; ComponentLink1URL: https://datasheet.ciiva.com/17068/pyu-rc0402-51-rohs-l-6-r-17068614.pdf?src-supplier=Future+Electronics; ComponentLink1Description: https://datasheet.ciiva.com/17068/pyu-rc0402-51-rohs-l-6-r-17068614.pdf?src-supplier=Future+Electronics; ComponentLink2URL: https://datasheet.ciiva.com/28398/pyu-rc0402-51-rohs-l-6-28398086.pdf?src-supplier=Avnet+Europe; ComponentLink2Description: https://datasheet.ciiva.com/28398/pyu-rc0402-51-rohs-l-6-28398086.pdf?src-supplier=Avnet+Europe; ComponentLink3URL: https://datasheet.ciiva.com/16867/pyu-rc0402-51-rohs-l-6-16867357.pdf?src-supplier=Avnet+Europe; ComponentLink3Description: https://datasheet.ciiva.com/16867/pyu-rc0402-51-rohs-l-6-16867357.pdf?src-supplier=Avnet+Europe; ComponentLink4URL: https://datasheet.ciiva.com/8888/pyu-rc0402-51-rohs-l-6-8888622.pdf?src-supplier=Avnet; ComponentLink4Description: https://datasheet.ciiva.com/8888/pyu-rc0402-51-rohs-l-6-8888622.pdf?src-supplier=Avnet; Supplier Part Number 1: 311-60.4KLRCT-ND
R7 = RC0402FR-0710KL: as R1 on sheet [03] - External Connectors; Manufacturer Part Number: RC0402FR-0710KL; RoHS: Yes; Case/Package: 0402; Number of Pins: 2; Case Code (Metric): 1005; Min Operating Temperature: -55°C; Max Operating Temperature: 155°C; Packaging: Tape and Reel; Composition: Thick Film; Voltage Rating (DC): 50V; Termination: SMD/SMT; Military Standard: Not; Working Voltage: 50V; Number of Terminations: 2; Length: 1mm; Height: 0.32mm; Width: 0.5mm; Depth: 0.5mm; Lead Pitch: 0.2mm; REACH SVHC: No SVHC; Lead Free: Lead Free; ComponentLink1URL: https://datasheet.ciiva.com/7660/38568-7660787.pdf?src-supplier=Element14; ComponentLink1Description: https://datasheet.ciiva.com/7660/38568-7660787.pdf?src-supplier=Element14; ComponentLink2URL: https://datasheet.ciiva.com/7849/1784430-7849813.pdf?src-supplier=Element14; ComponentLink2Description: https://datasheet.ciiva.com/7849/1784430-7849813.pdf?src-supplier=Element14; ComponentLink3URL: https://datasheet.ciiva.com/7849/1686128-7849814.pdf?src-supplier=Element14; ComponentLink3Description: https://datasheet.ciiva.com/7849/1686128-7849814.pdf?src-supplier=Element14; ComponentLink4URL: https://datasheet.ciiva.com/7849/1784430-7849815.pdf?src-supplier=Element14; ComponentLink4Description: https://datasheet.ciiva.com/7849/1784430-7849815.pdf?src-supplier=Element14; ComponentLink5URL: https://datasheet.ciiva.com/22747/1018594-22747512.pdf?src-supplier=Element14; ComponentLink5Description: https://datasheet.ciiva.com/22747/1018594-22747512.pdf?src-supplier=Element14; ComponentLink6URL: https://datasheet.ciiva.com/12667/pyu-rc0402-51-rohs-l-6-r-12667067.pdf?src-supplier=Mouser; ComponentLink6Description: https://datasheet.ciiva.com/12667/pyu-rc0402-51-rohs-l-6-r-12667067.pdf?src-supplier=Mouser; ComponentLink7URL: https://datasheet.ciiva.com/7983/1018594-7983486.pdf?src-supplier=Element14; ComponentLink7Description: https://datasheet.ciiva.com/7983/1018594-7983486.pdf?src-supplier=Element14; Package Quantity: 10000; ComponentLink8URL: https://datasheet.ciiva.com/11819/0900766b80c66297-11819487.pdf?src-supplier=RSComponents; ComponentLink8Description: https://datasheet.ciiva.com/11819/0900766b80c66297-11819487.pdf?src-supplier=RSComponents; ComponentLink9URL: https://datasheet.ciiva.com/15189/getdatasheetpartid-329253-15189431.pdf?src-supplier=Verical; ComponentLink9Description: https://datasheet.ciiva.com/15189/getdatasheetpartid-329253-15189431.pdf?src-supplier=Verical; ComponentLink10URL: https://datasheet.ciiva.com/24070/pyu-rc0402-51-rohs-l-6-r-8721-24070077.pdf?src-supplier=Mouser; ComponentLink10Description: https://datasheet.ciiva.com/24070/pyu-rc0402-51-rohs-l-6-r-8721-24070077.pdf?src-supplier=Mouser; ComponentLink11URL: https://datasheet.ciiva.com/7849/1018594-7849966.pdf?src-supplier=Element14; ComponentLink11Description: https://datasheet.ciiva.com/7849/1018594-7849966.pdf?src-supplier=Element14; ComponentLink12URL: https://datasheet.ciiva.com/7849/1018594-7849967.pdf?src-supplier=Element14; ComponentLink12Description: https://datasheet.ciiva.com/7849/1018594-7849967.pdf?src-supplier=Element14; ComponentLink13URL: https://datasheet.ciiva.com/17070/pyu-rc0402-51-rohs-l-6-r-17070335.pdf?src-supplier=Future+Electronics; ComponentLink13Description: https://datasheet.ciiva.com/17070/pyu-rc0402-51-rohs-l-6-r-17070335.pdf?src-supplier=Future+Electronics; Supplier 1: Digi-Key; Stock 1: 86154015; Pricing 1: 1 = 0,10000, 10 = 0,01600, 100 = 0,00670, 1000 = 0,00301, 2500 = 0,00261, 5000 = 0,00215 (USD); Supplier Part Number 1: 311-10.0KLRCT-ND
U1 = AP3419KTTR-G1: IC REGULATOR BUCK 2A SYNC 1MHZ SOT-23-6; Manufacturer: Diodes; Number of Outputs: 1; Min Input Voltage: 2.7V; Max Input Voltage: 5.5V; Min Output Voltage: 600mV; Synchronous Rectifier: Yes; Output Type: Adjustable; Output Configuration: Positive; Supplier 1: Digi-Key; Manufacturer Part Number: AP3419KTTR-G1; Stock 1: 72992; Pricing 1: 1 = 0,42000, 10 = 0,33900, 100 = 0,23070, 500 = 0,17304, 1000 = 0,12978 (USD); RoHS: Yes; Mount: Surface Mount; Case/Package: SOT-23-6; Min Operating Temperature: -40°C; Max Operating Temperature: 85°C; Packaging: Tape and Reel; Max Output Voltage: 5.5V; Output Current: 2A; Switching Frequency: 1MHz; ComponentLink1URL: https://www.diodes.com/assets/Datasheets/AP3419.pdf?src-supplier=Digi-Key; ComponentLink1Description: https://www.diodes.com/assets/Datasheets/AP3419.pdf?src-supplier=Digi-Key; Supplier Part Number 1: AP3419KTTR-G1DICT-ND